# Altium schematic sheet comms.SchDoc: Communications
size A4; DocumentNumber: 3; SheetNumber: 3; SheetTotal: 6
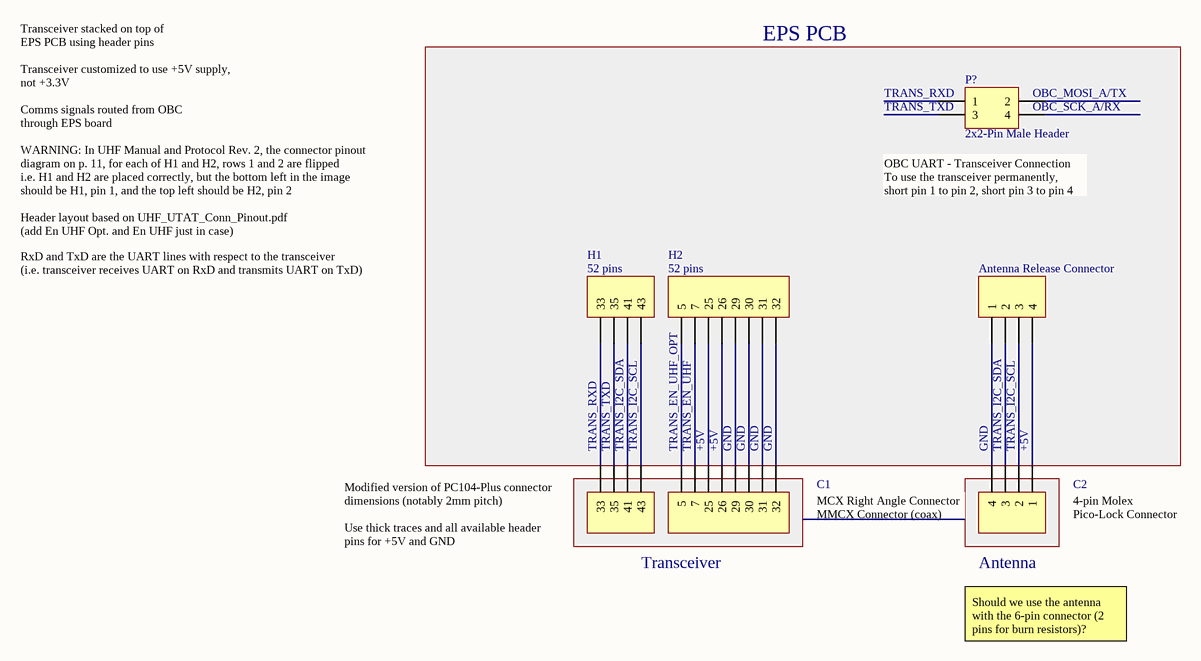
[diagram p0: comms.SchDoc]

## Parts
(Parts that share a designator on the sheet are numbered #1, #2 ... from top to bottom, then left to right.)
C?  Antenna Release Connector  [HDR1X4]  (value not drawn)
P?#1  Header 2X2  [HDR2X2]  (value not drawn)
P?#2  Header 4  [HDR1X4]  (value not drawn)
P?#3  Header 8  [HDR1X8]  (value not drawn)
P?#4  Antenna Release Connector  [HDR1X4]  (value not drawn)
P?#5  Header 4  [HDR1X4]  (value not drawn)
P?#6  Header 8  [HDR1X8]  (value not drawn)

## Blocks framed on the sheet
EPS PCB: P?#1-P?#4

## Nets
NetC?_1: C?.1 P?#4.4
NetC?_2: C?.2 P?#4.3
NetC?_3: C?.3 P?#4.2
NetC?_4: C?.4 P?#4.1
NetP?#2_1: P?#2.1(33) P?#5.1(33)
NetP?#2_2: P?#2.2(35) P?#5.2(35)
NetP?#2_3: P?#2.3(41) P?#5.3(41)
NetP?#2_4: P?#2.4(43) P?#5.4(43)
NetP?#3_1: P?#3.1(5) P?#6.1(5)
NetP?#3_2: P?#3.2(7) P?#6.2(7)
NetP?#3_3: P?#3.3(25) P?#6.3(25)
NetP?#3_4: P?#3.4(26) P?#6.4(26)
NetP?#3_5: P?#3.5(29) P?#6.5(29)
NetP?#3_6: P?#3.6(30) P?#6.6(30)
NetP?#3_7: P?#3.7(31) P?#6.7(31)
NetP?#3_8: P?#3.8(32) P?#6.8(32)

Not connected (* = marked no-connect by the designer): P?#1 1 2 3 4

## Notes on the sheet
- Transceiver stacked on top of EPS PCB using header pins
- Transceiver customized to use +5V supply, not +3.3V
  To get 2W of power
  (add En UHF Opt. and En UHF just in case)
- (near P?#1) TRANS_RXD
- (near P?#1) TRANS_TXD
- (near P?#1) OBC_MOSI_A/TX
- (near P?#1) OBC_SCK_A/RX
- Comms signals routed from OBC through EPS board
- (near P?#1) 2x2-Pin Male Header
- Header layout based on UHF_UTAT_Conn_Pinout.pdf
  (add En UHF Opt. and En UHF just in case)
- WARNING: In UHF Manual and Protocol Rev. 2, the connector pinout diagram on p. 11, for each of H1 and H2, rows 1 and 2 are flipped
  i.e. H1 and H2 are placed correctly, but the bottom left in the image should be H1, pin 1, and the top left should be H2, pin 2
- (near P?#1) OBC UART - Transceiver Connection
  To use the transceiver permanently,
  short pin 1 to pin 2, short pin 3 to pin 4
- RxD and TxD are the UART lines with respect to the transceiver
  (i.e. transceiver receives UART on RxD and transmits UART on TxD)
- (near P?#2) 52 pins
- H1
- (near P?#3) 52 pins
- H2
- (near P?#4) Antenna Release Connector
- (near P?#5) TRANS_RXD
- (near P?#5) TRANS_TXD
- (near P?#5) TRANS_I2C_SDA
- (near P?#5) TRANS_I2C_SCL
- (near P?#3) TRANS_EN_UHF_OPT
- (near P?#6) TRANS_EN_UHF
- (near P?#6) +5V
- (near P?#6) GND
- (near C?) GND
- TRANS_I2C_SDA
- TRANS_I2C_SCL
- (near C?) +5V
- (near P?#5) Modified version of PC104-Plus connector dimensions (notably 2mm pitch)
- (near P?#6) C1
- MCX Right Angle Connector
  MMCX Connector (coax)
- (near C?) 4-pin Molex Pico-Lock Connector
- (near C?) C2
- (near P?#5) Use thick traces and all available header pins for +5V and GND
- Transceiver
- Antenna
- Should we use the antenna with the 6-pin connector (2 pins for burn resistors)?

## Library data of the parts
C? P?#2 P?#4 P?#5 = Header 4: Header, 4-Pin; LatestRevisionDate: 17-Jul-2002; LatestRevisionNote: Re-released for DXP Platform.; Publisher: Altium Limited
P?#1 = Header 2X2: Header, 2-Pin, Dual row; LatestRevisionDate: 17-Jul-2002; LatestRevisionNote: Re-released for DXP Platform.; Publisher: Altium Limited
P?#3 P?#6 = Header 8: Header, 8-Pin; LatestRevisionDate: 17-Jul-2002; LatestRevisionNote: Re-released for DXP Platform.; Publisher: Altium Limited